# EAGLE design magnetophone (EAGLE 7.6.0)
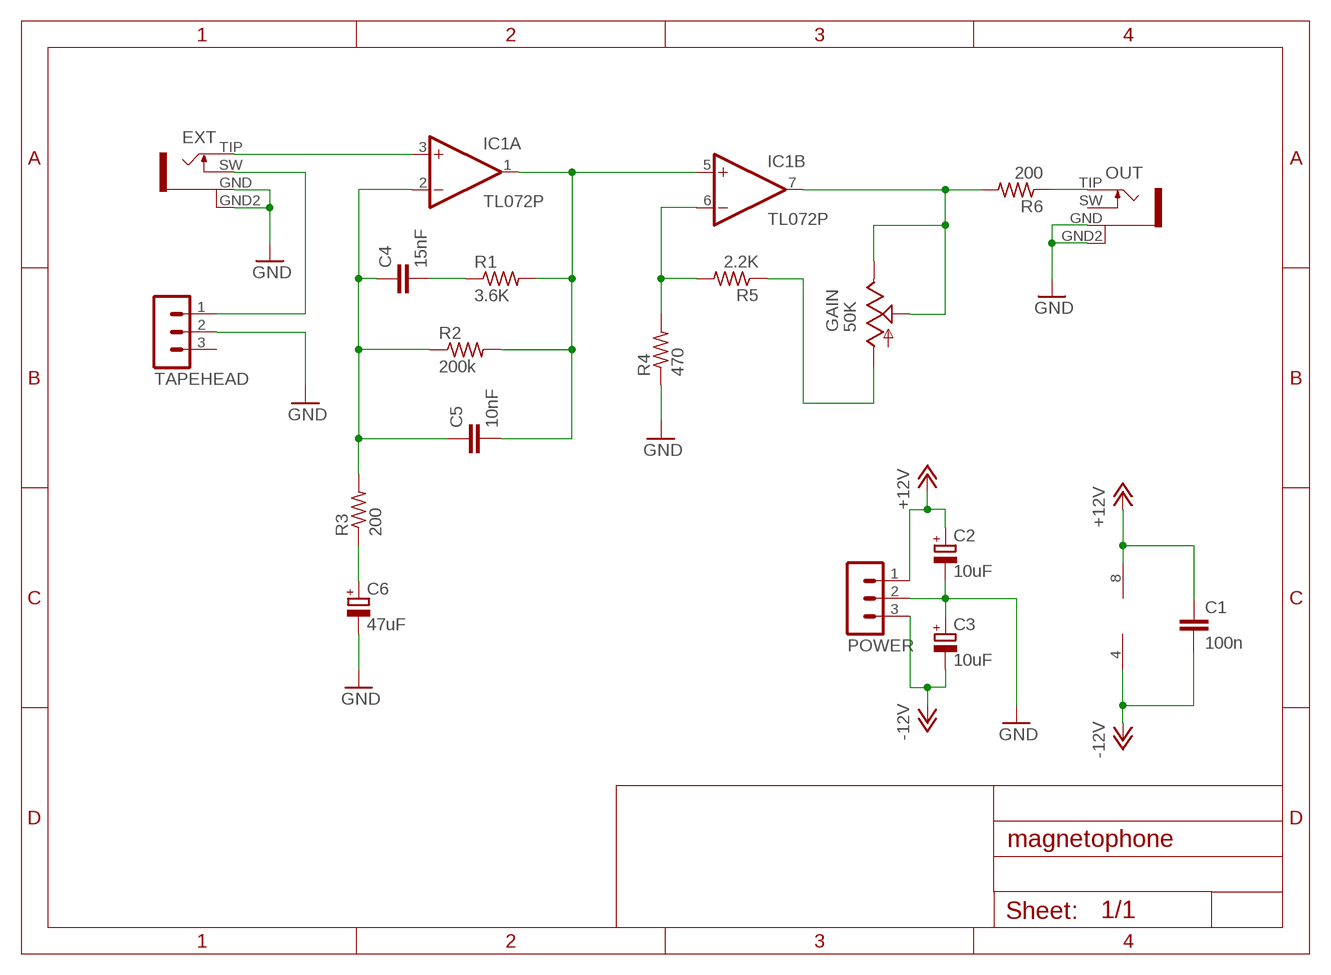
[diagram p0: schematic, sheet 1]

## Parts
C1  100n  C-EU025-025X050  [C025-025X050]
C2  10uF  CPOL-EUE2,5-6E  [E2,5-6E]
C3  10uF  CPOL-EUE2,5-6E  [E2,5-6E]
C4  15nF  C-EU025-025X050  [C025-025X050]
C5  10nF  C-EU025-025X050  [C025-025X050]
C6  47uF  CPOL-EUE2,5-6E  [E2,5-6E]
EXT  PJ301BM  [PJ301]
GAIN  50K  9MM_SNAP-IN_POT_  [9MM_SNAP-IN_POT]
IC1  TL072P  [DIL08]
OUT  PJ301BM  [PJ301]
POWER  MA03-1  [MA03-1]
R1  3.6K  R-US_0207/10  [0207/10]
R2  200k  R-US_0207/10  [0207/10]
R3  200  R-US_0207/10  [0207/10]
R4  470  R-US_0207/10  [0207/10]
R5  2.2K  R-US_0207/10  [0207/10]
R6  200  R-US_0207/10  [0207/10]
TAPEHEAD  MA03-1  [MA03-1]

## Nets
+12V: C1.1 C2.+ IC1.8(P:V+) POWER.1
-12V: C1.2 C3.- IC1.4(P:V-) POWER.3
GND: C2.- C3.+ C6.- EXT.GND EXT.GND2 OUT.GND OUT.GND2 POWER.2 R4.1 TAPEHEAD.2
N$1: EXT.SW TAPEHEAD.1
N$2: C4.1 C5.1 IC1.2(A:-IN) R2.1 R3.2
N$3: C5.2 IC1.1(A:OUT) IC1.5(B:+IN) R1.2 R2.2
N$4: C6.+ R3.1
N$5: EXT.TIP IC1.3(A:+IN)
N$6: C4.2 R1.1
N$7: IC1.6(B:-IN) R4.2 R5.2
N$9: GAIN.1(A) R5.1
N$10: GAIN.2(S) GAIN.3(E) IC1.7(B:OUT) R6.2
N$13: OUT.TIP R6.1
Unconnected: OUT.SW TAPEHEAD.3

## Library data of the parts
C1 C4 C5 = resistor:C-EU: CAPACITOR, European symbol
C2 C3 C6 = resistor:CPOL-EU: POLARIZED CAPACITOR, European symbol
EXT OUT = tim2:PJ301
GAIN = tim2:9MM_SNAP-IN_POT: 9mm vertical snap-in pot, Alpha / Panasonic style
IC1 = linear:TL072: OP AMP
POWER TAPEHEAD = con-lstb:MA03-1: PIN HEADER; OC_FARNELL: unknown; OC_NEWARK: unknown
R1-R6 = resistor:R-US_: RESISTOR, American symbol

## Board
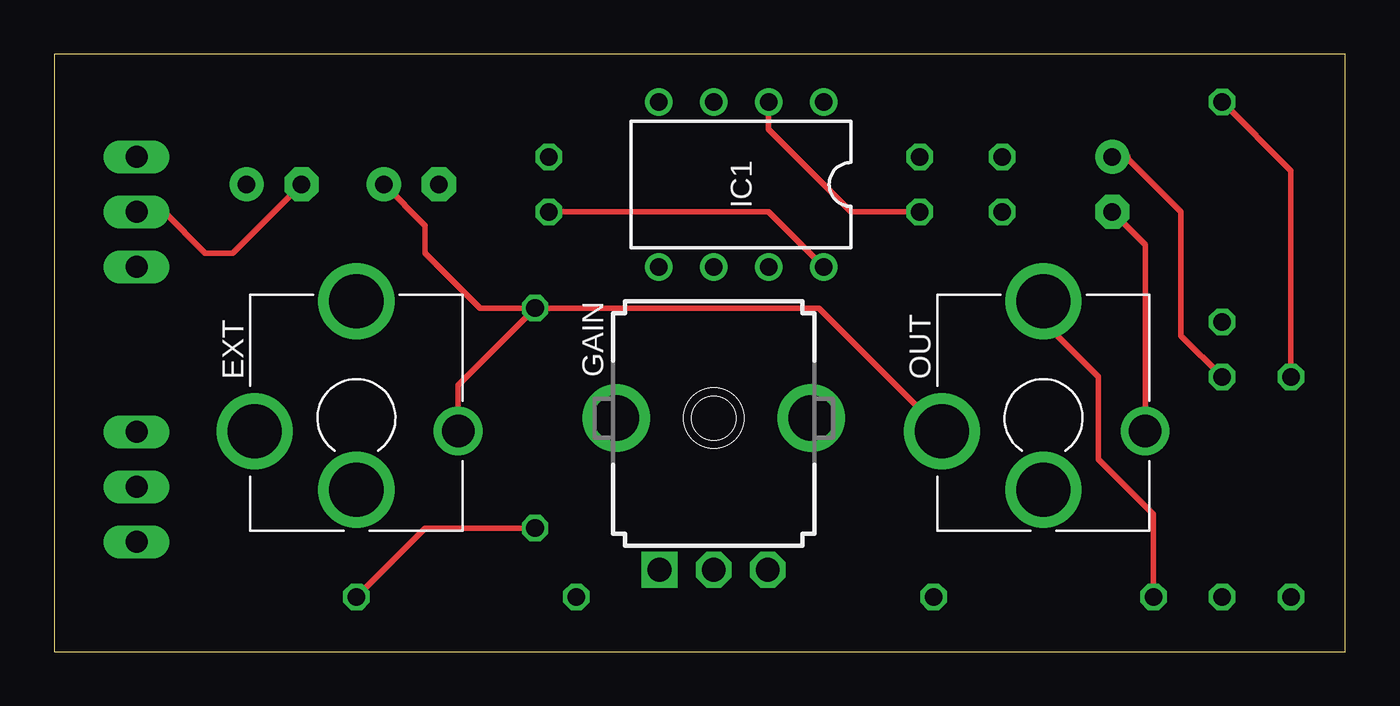
[diagram p1: board, top side]
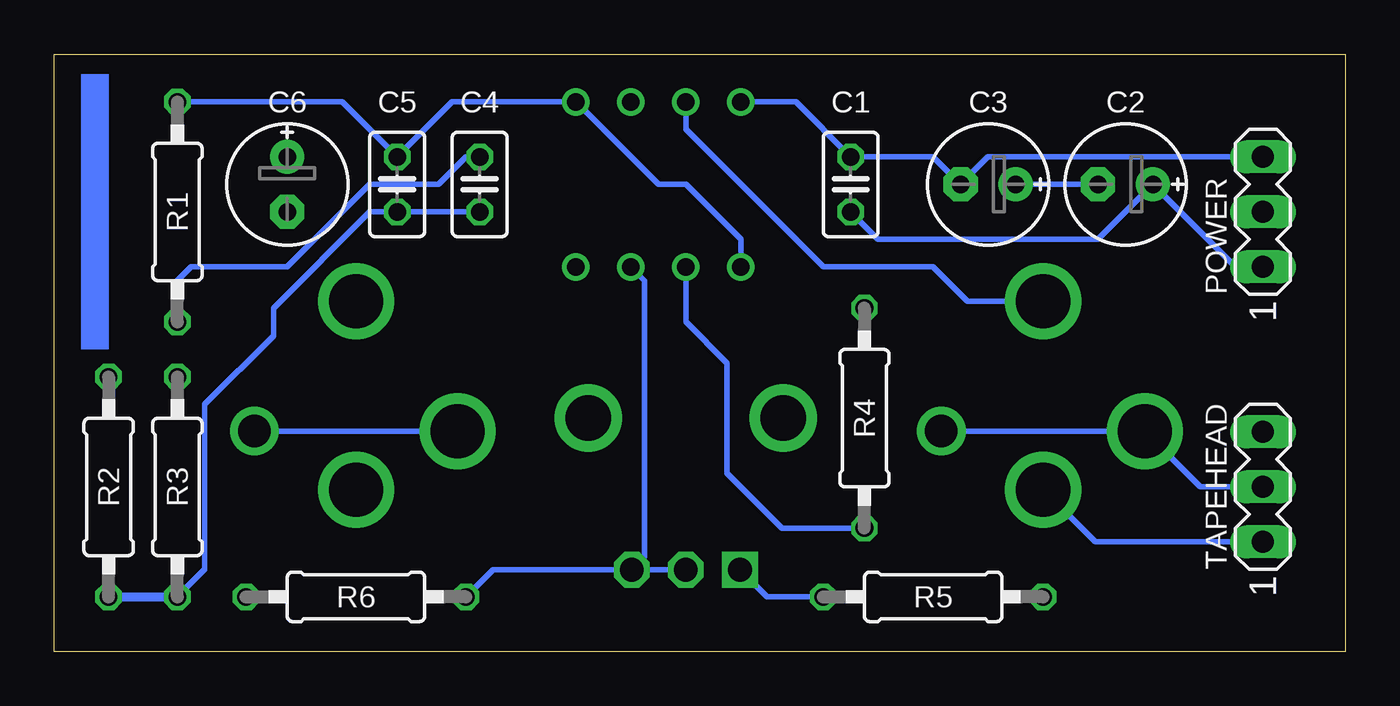
[diagram p2: board, bottom side, seen from below]

Size 59.67 x 27.61 mm. Coordinates in mm from the lower left corner, seen from the top.
Outline: 0,0 59.67,0 59.67,27.61 0,27.61 0,0
Copper layers (1*16): Top 0.035559375mm / dielectric 1.6mm / Bottom 0.035559375mm
Design rules "jlcpcb2layer": minimum track width 5mil, minimum drill 12mil, track to track 5mil, track to pad 5mil, pad to pad 5mil, via to via 5mil, smd to smd 5mil, copper to edge 8mil, drill to drill 6mil, minimum pad ring 5mil, minimum via ring 3mil, stop-mask expansion 2.5mil, vias tented up to drill 0mil, thermal gap 10mil

### Footprints (pad centres in the part's own frame; a part is rotated, then mirrored left to right if it is on the bottom)
C025-025X050 = drill 0.813 octagon: 1 -1.27,0; 2 1.27,0
E2,5-6E = drill 0.813 pad 1.575: + -1.27,0 | drill 0.813 pad 1.575 octagon: - 1.27,0
PJ301 = drill 2.5: GND -4.7,-0.6; SW 0,-3.3; TIP 0,5.4 | drill 1.5: GND2 4.7,-0.6
9MM_SNAP-IN_POT = drill 1.1 square: 1 -2.5,-7 | drill 1.1 octagon: 2 0,-7; 3 2.5,-7 | drill 2.1 pad 2.794: CHASSIS1 -4.5,0; CHASSIS2 4.5,0
DIL08 = drill 0.813 pad 1.27: 1 -3.81,-3.81; 2 -1.27,-3.81; 3 1.27,-3.81; 4 3.81,-3.81; 5 3.81,3.81; 6 1.27,3.81; 7 -1.27,3.81; 8 -3.81,3.81
MA03-1 = drill 1.016 long: 1 -2.54,0; 2 0,0; 3 2.54,0
0207/10 = drill 0.813 octagon: 1 -5.08,0; 2 5.08,0

### Placement (x,y rotation side)
C1  22.86,21.59 90 bottom
C2  10.16,21.59 180 bottom
C3  16.51,21.59 180 bottom
C4  40.01,21.59 90 bottom
C5  43.81,21.59 90 bottom
C6  48.9,21.59 270 bottom
EXT  13.97,10.79 0 top
GAIN  30.48,10.79 0 top
IC1  31.75,21.59 180 top
OUT  45.72,10.79 0 top
POWER  3.81,20.32 90 bottom
R1  53.98,20.32 90 bottom
R2  57.15,7.62 90 bottom
R3  53.98,7.62 270 bottom
R4  22.23,10.79 270 bottom
R5  19.05,2.54 0 bottom
R6  45.72,2.54 0 bottom
TAPEHEAD  3.81,7.62 90 bottom

### Tracks (layer width: path | path; a pad name or v marks a point on that pad's centre or on a via)
+12V
  Top 0.254: C1.1 33.02,20.32 IC1.8
  Bottom 0.254: 5.08,17.78 C2.+ 11.43,19.05 21.59,19.05 C1.1
  Bottom 0.406: POWER.1 5.08,17.78
-12V
  Bottom 0.254: POWER.3 16.51,22.86 C3.- 19.05,22.86 C1.2 25.4,25.4 IC1.4
GND
  Top 0.254: EXT.GND2 18.67,12.32 R4.1 | OUT.GND2 50.42,18.8 C6.- | R4.1 35.34,15.88 OUT.GND | POWER.2 5.08,20.32 6.99,18.41 8.26,18.41 C2.- | C3.+ 17.14,19.68 17.14,18.41 19.68,15.88 R4.1
  Bottom 0.254: C3.+ C2.- | TAPEHEAD.2 6.7,7.62 EXT.GND EXT.GND2 | OUT.GND OUT.GND2
N$1
  Bottom 0.254: TAPEHEAD.1 11.55,5.08 EXT.SW
N$2
  Top 0.254: IC1.2 33.02,24.13 36.83,20.32 C4.1
  Bottom 0.254: C4.1 C5.1 45.09,20.32 49.53,15.88 49.53,14.61 52.7,11.43 52.7,3.81 R3.2
  Bottom 0.406: R2.1 R3.2
N$3
  Top 0.254: R2.2 57.15,22.23 R1.2
  Bottom 0.254: R1.2 46.35,25.4 C5.2 41.27,25.4 IC1.1 31.75,21.59 30.48,21.59 27.94,19.05 IC1.5
N$4
  Top 0.254: 49.53,22.86 52.07,20.32 52.07,14.61 R3.1
  Top 0.406: C6.+ 49.53,22.86
N$5
  Bottom 0.254: IC1.3 30.48,24.13 24.13,17.78 19.05,17.78 17.46,16.2 EXT.TIP
N$6
  Bottom 0.254: C4.2 40.64,22.86 41.91,21.59 45.09,21.59 48.9,17.78 53.34,17.78 53.98,17.14 R1.1
N$7
  Top 0.254: R4.2 17.14,5.71 R5.2
  Bottom 0.254: R4.2 26.04,5.71 28.57,8.26 28.57,13.34 30.48,15.24 IC1.6
N$9
  Bottom 0.254: R5.1 26.73,2.54 GAIN.1
N$10
  Bottom 0.254: GAIN.2 GAIN.3 | IC1.7 32.38,17.14 32.38,4.39 GAIN.3 | GAIN.3 39.38,3.79 R6.2
N$13
  Top 0.254: OUT.TIP 45.72,15.24 48.26,12.7 48.26,8.89 50.8,6.35 R6.1
(copper drawn outside any net)
  shapes: Bottom area x1

### Text on the board
bStop: Magnetophon v1.0